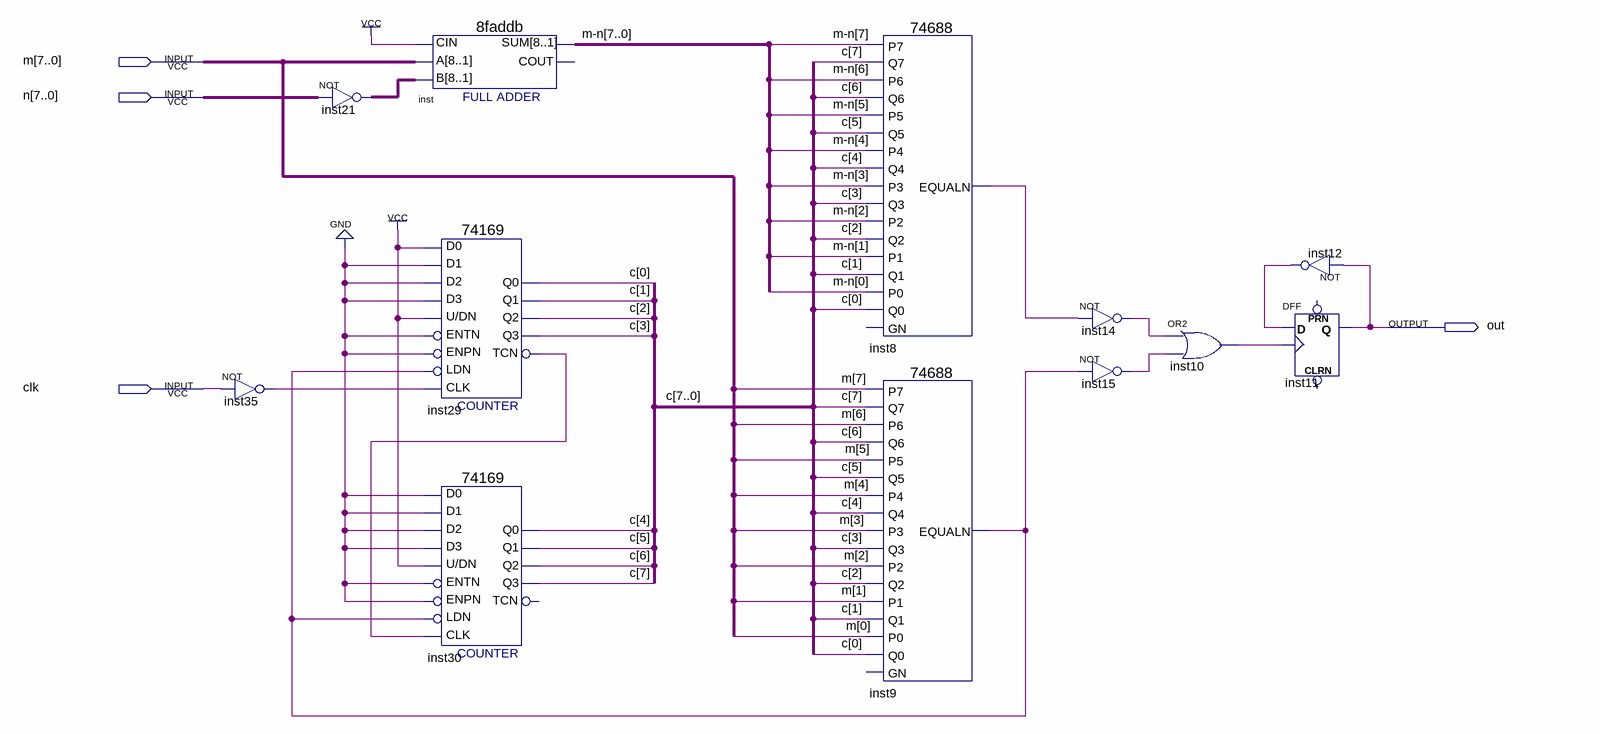
[diagram p0: schematic sheet]
// Quartus schematic Block1.bdf as structural Verilog: 12 symbols, 4 pins
module Block1 (
  input  [7:0] m,
  input  [7:0] n,
  input  clk,
  output out
);

  wire inst8_equaln, inst9_equaln, inst10_out, inst12_out, inst14_out, inst15_out, inst29_tcn, inst35_out;
  wire [7:0] c, inst21_out, \m-n ;

  not inst35 (inst35_out, clk);
  assign inst21_out = ~n;  // NOT inst21, 8 bits wide
  \8faddb  inst (.CIN(1'b1), .A(m), .B(inst21_out), .SUM(\m-n ));  // open: COUT
  \74169  inst29 (
    .D1(1'b0), .D2(1'b0), .D0(1'b1), .ENTN(1'b0), .\U/DN (1'b1), .D3(1'b0), .LDN(inst9_equaln),
    .CLK(inst35_out), .ENPN(1'b0), .Q2(c[2]), .Q1(c[1]), .Q0(c[0]), .TCN(inst29_tcn), .Q3(c[3]));
  \74169  inst30 (
    .D1(1'b0), .D2(1'b0), .D0(1'b0), .ENTN(1'b0), .\U/DN (1'b1), .D3(1'b0), .LDN(inst9_equaln),
    .CLK(inst29_tcn), .ENPN(1'b0), .Q2(c[6]), .Q1(c[5]), .Q0(c[4]), .Q3(c[7]));  // open: TCN
  \74688  inst8 (
    .P6(\m-n [6]), .Q3(c[3]), .P3(\m-n [3]), .Q4(c[4]), .P4(\m-n [4]), .Q2(c[2]), .P1(\m-n [1]), .Q1(c[1]),
    .P0(\m-n [0]), .Q0(c[0]), .P2(\m-n [2]), .Q7(c[7]), .Q5(c[5]), .P5(\m-n [5]), .Q6(c[6]), .P7(\m-n [7]),
    .EQUALN(inst8_equaln));  // open: GN
  \74688  inst9 (
    .P6(m[6]), .Q3(c[3]), .P3(m[3]), .Q4(c[4]), .P4(m[4]), .Q2(c[2]), .P1(m[1]), .Q1(c[1]), .P0(m[0]),
    .Q0(c[0]), .P2(m[2]), .Q7(c[7]), .Q5(c[5]), .P5(m[5]), .Q6(c[6]), .P7(m[7]), .EQUALN(inst9_equaln));  // open: GN
  not inst14 (inst14_out, inst8_equaln);
  not inst15 (inst15_out, inst9_equaln);
  or inst10 (inst10_out, inst14_out, inst15_out);
  not inst12 (inst12_out, out);
  DFF inst11 (.CLK(inst10_out), .D(inst12_out), .Q(out));  // open: CLRN, PRN
endmodule
